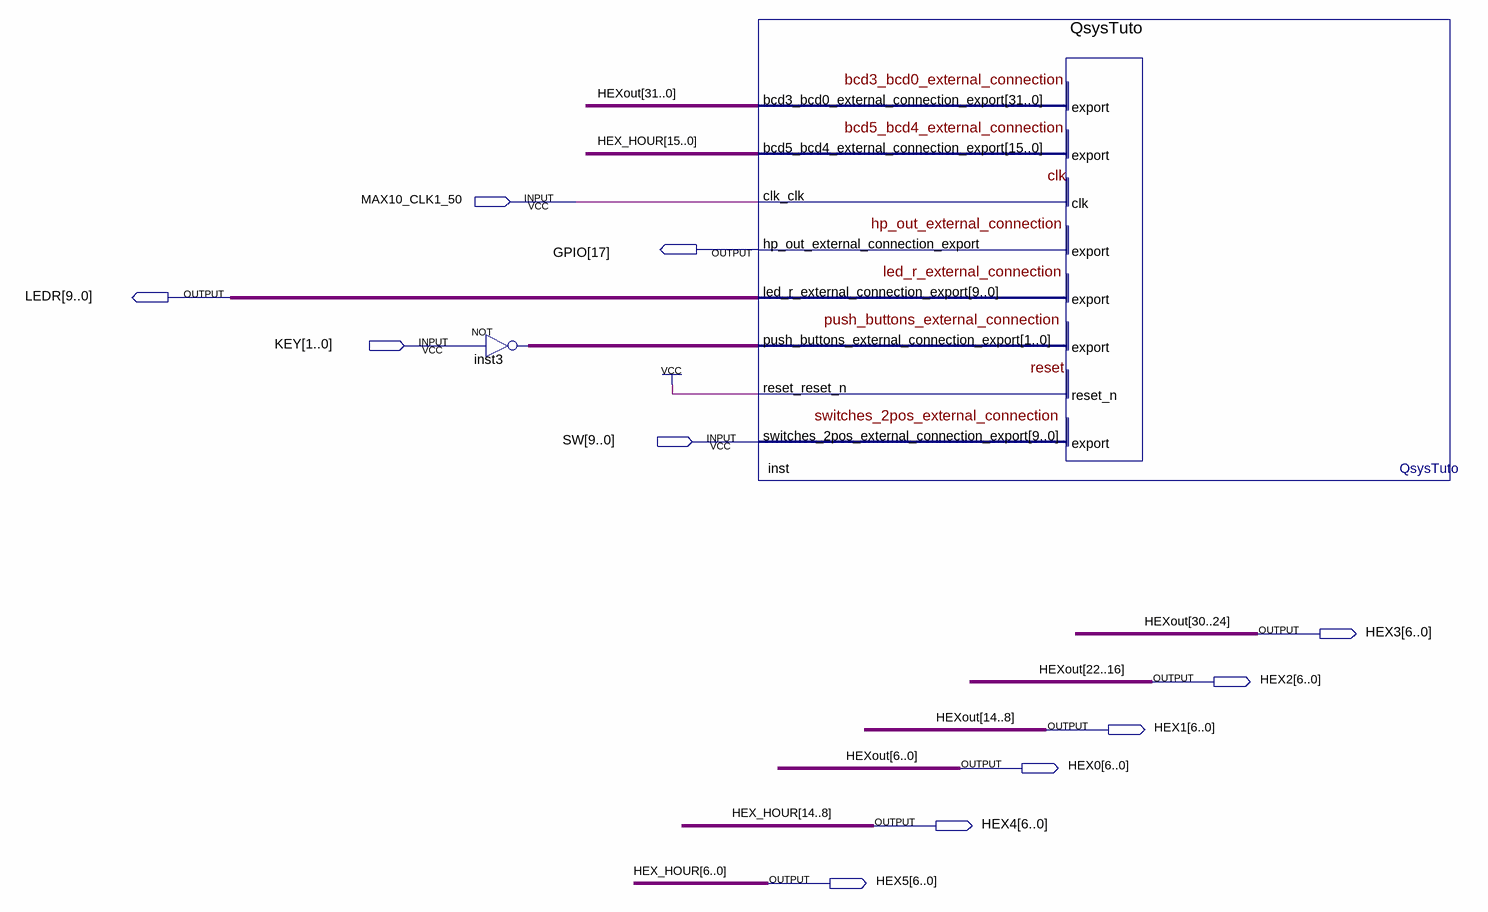
[diagram p0: schematic sheet]
// Quartus schematic DE10_LITE.bdf as structural Verilog: 2 symbols, 11 pins
module DE10_LITE (
  input  MAX10_CLK1_50,
  input  [1:0] KEY,
  input  [9:0] SW,
  output [17:17] GPIO,
  output [9:0] LEDR,
  output [6:0] HEX3,
  output [6:0] HEX2,
  output [6:0] HEX1,
  output [6:0] HEX0,
  output [6:0] HEX4,
  output [6:0] HEX5
);

  wire [1:0] inst3_out;
  wire [15:7] HEX_HOUR;
  wire [31:7] HEXout;

  assign inst3_out = ~KEY;  // NOT inst3, 2 bits wide
  QsysTuto inst (
    .clk_clk(MAX10_CLK1_50), .push_buttons_external_connection_export(inst3_out), .reset_reset_n(1'b1),
    .switches_2pos_external_connection_export(SW),
    .bcd3_bcd0_external_connection_export({HEXout[31], HEX3, HEXout[23], HEX2, HEXout[15], HEX1, HEXout[7], HEX0}),
    .bcd5_bcd4_external_connection_export({HEX_HOUR[15], HEX4, HEX_HOUR[7], HEX5}),
    .hp_out_external_connection_export(GPIO[17]), .led_r_external_connection_export(LEDR));

  // Other names for the same wires on the sheet: HEX_HOUR (some bits) = {HEX4, HEX5};
  //   HEXout (some bits) = {HEX3, HEX2, HEX1, HEX0}
endmodule
